# Altium schematic sheet USB_Interface.SchDoc
size A
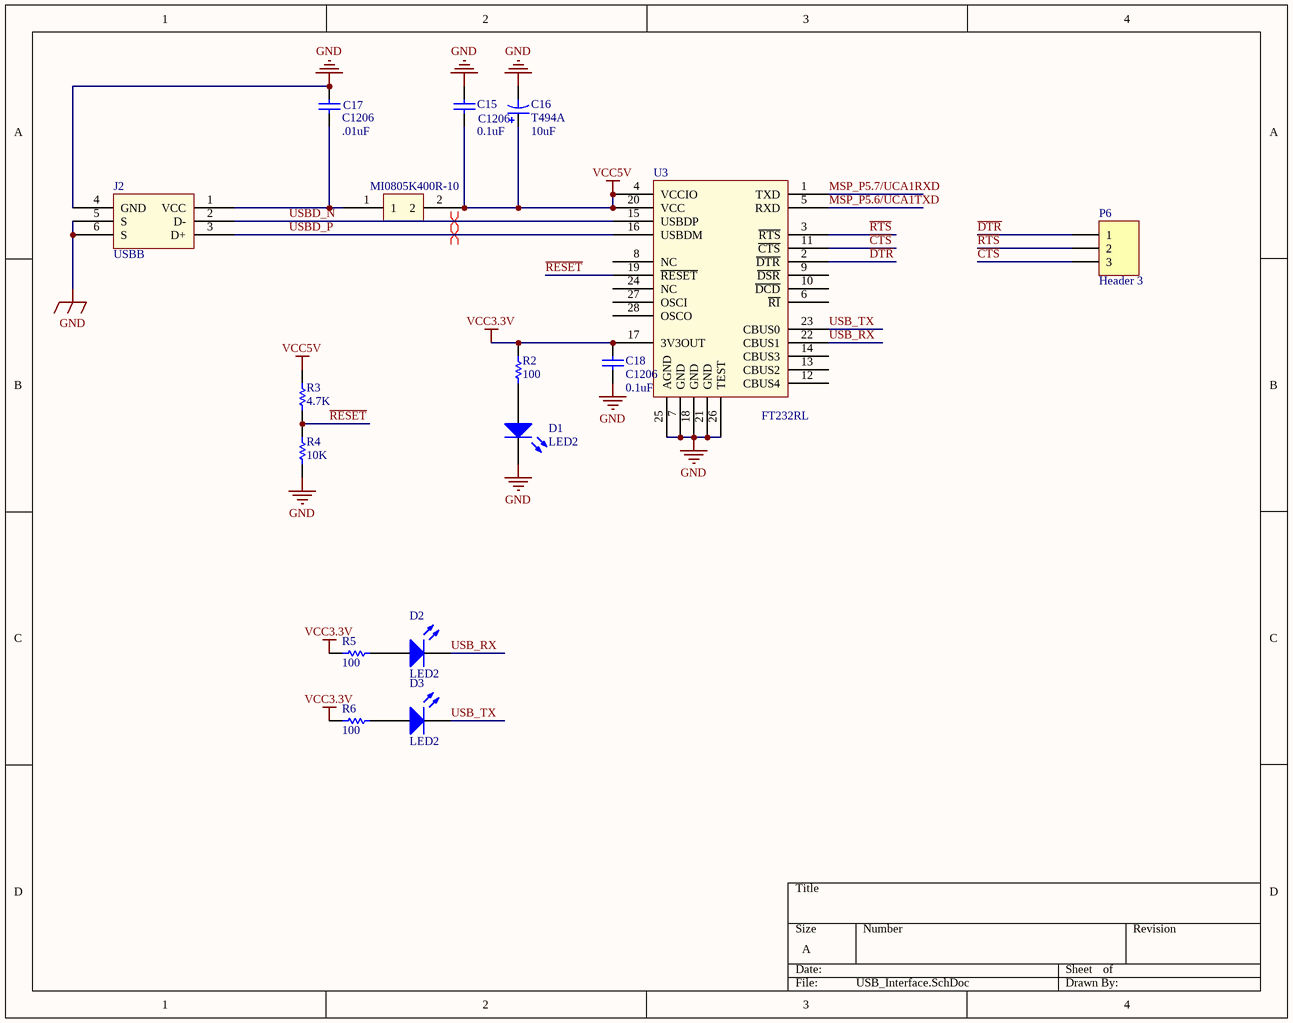
[diagram p0: USB_Interface.SchDoc]

## Parts
C15  C1206  value 0.1uF  [1206]
C16  T494A  value 10uF  [A]
C17  C1206  value .01uF  [1206]
C18  C1206  value 0.1uF  [1206]
D1  LED2  [LED_LiteOn_footprint]
D2  LED2  [LED_LiteOn_footprint]
D3  LED2  [LED_LiteOn_footprint]
J2  USBB  [PCBComponent_1]
P6  Header 3  [HDR1X3]
R2  100  [8-1206]
R3  4.7K  [8-1206]
R4  10K  [8-1206]
R5  100  [8-1206]
R6  100  [8-1206]
U3  FT232RL  [SOP65P780X200-28N]
U4  MI0805K400R-10  [INDC2012X11N]

## Nets
GND: C15.2 C16.2 C17.1 C18.1 D1.2(K) J2.4(GND) J2.5(S) J2.6(S) R4.2 U3.7(GND) U3.18(GND) U3.21(GND) U3.25(AGND) U3.26(TEST)
VCC3.3V: C18.2 R2.2 R5.1 R6.1 U3.17(3V3OUT)
VCC5V: C15.1 C16.1 R3.1 U3.4(VCCIO) U3.20(VCC) U4.2
~{CTS}: P6.3 U3.11(~{CTS})
~{DTR}: P6.1 U3.2(~{DTR})
MSP_P5.6/UCA1TXD: U3.5(RXD)
MSP_P5.7/UCA1RXD: U3.1(TXD)
~{RESET}: R3.2 R4.1 U3.19(~{RESET})
~{RTS}: P6.2 U3.3(~{RTS})
USB_RX: D2.2(K) U3.22(CBUS1)
USB_TX: D3.2(K) U3.23(CBUS0)
USBD_N: J2.2(D-) U3.15(USBDP)
USBD_P: J2.3(D+) U3.16(USBDM)
NetC17_2: C17.2 J2.1(VCC) U4.1
NetD1_1: D1.1(A) R2.1
NetD2_1: D2.1(A) R5.2
NetD3_1: D3.1(A) R6.2

Not connected (* = marked no-connect by the designer): U3 6(~{RI}) 8(NC) 9(~{DSR}) 10(~{DCD}) 12(CBUS4) 13(CBUS2) 14(CBUS3) 24(NC) 27(OSCI) 28(OSCO)

## Layout directives
differential pair: USBD_N, USBD_P

## Library data of the parts
C15 C17 C18 = C1206: Ceramic Chip Capacitor - Standard; Published: 17-Jul-2002; LatestRevisionDate: 19-Mar-2004; LatestRevisionNote: Silkscreen size reduced.; DatasheetDocument: Mar-2001; PackageDocument: Mar-2001; PackageReference: 1206; Publisher: Altium Limited; Code_JEITA: 1206; Code_IPC: 3216 [1206]; ComponentLink1Description: Manufacturer Link; ComponentLink1URL: http://www.kemet.com/; ComponentLink2Description: Datasheet; ComponentLink2URL: http://www.kemet.com/kemet/web/homepage/kechome.nsf/vapubfilesname/F3102TA.pdf/$file/F3102TA.pdf
C16 = T494A: Solid Tantalum Chip Capacitor, Standard T494 Series - Low ESR, Industrial Grade; Published: 17-Jul-2002; LatestRevisionDate: 19-Mar-2004; LatestRevisionNote: Silkscreen dimensions re-sized.; DatasheetDocument: Mar-2001; PackageDocument: Mar-2001; PackageReference: A; Publisher: Altium Limited; Code_JEITA: 3216-18; ComponentLink1Description: Manufacturer Link; ComponentLink1URL: http://www.kemet.com/; ComponentLink2Description: Datasheet; ComponentLink2URL: http://www.kemet.com/kemet/web/homepage/kechome.nsf/vapubfilesname/F3102TA.pdf/$file/F3102TA.pdf
D1-D3 = LED2: Typical RED, GREEN, YELLOW, AMBER GaAs LED
P6 = Header 3: Header, 3-Pin; LatestRevisionDate: 17-Jul-2002; LatestRevisionNote: Re-released for DXP Platform.; Publisher: Altium Limited
R2-R6 = ERJ8GE: Thick Film Chip Resistor, 1 Ohm to 10M Ohm Range, 5% Tolerance, 1206 Size, 0.25 W; Note: If flow soldering, adjust pad width of PCB Footprint to 0.7 - 0.8 times the width of the resistor.; Published: 17-Dec-2003; LatestRevisionDate: 19-Mar-2004; LatestRevisionNote: Silkscreen size reduced.; PackageDocument: Mar-2003; PackageReference: 8-1206; Publisher: Altium Limited; Code_IPC: 3216 [1206]; ComponentLink1Description: Manufacturer Link; ComponentLink1URL: http://www.panasonic.com/industrial/components/resistive_products.htm; ComponentLink2Description: Datasheet; ComponentLink2URL: http://www.panasonic.com/industrial/components/pdf/AOA0000CE1.pdf
U4 = ferrite bead